# Altium schematic sheet 连接.SchDoc
size A4
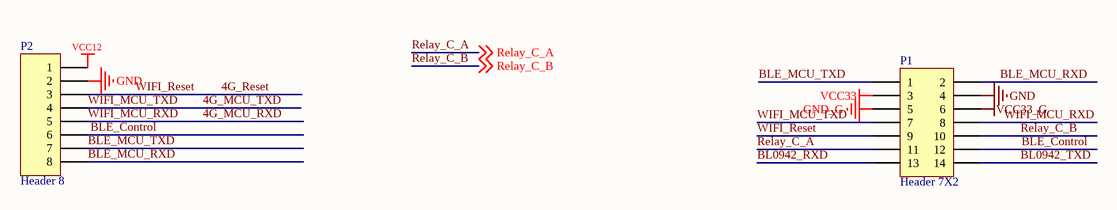
[diagram p0: 连接.SchDoc]

## Parts
P1  Header 7X2  [HDR2X7]
P2  Header 8  [HDR1X8]

## Nets
GND: P1.4 P2.2
GND_G: P1.5
VCC12: P2.1
VCC33: P1.3
VCC33_G: P1.6
4G_MCU_RXD: P1.8 P2.5  [also labelled WIFI_MCU_RXD]
4G_MCU_TXD: P1.7 P2.4  [also labelled WIFI_MCU_TXD]
4G_Reset: P1.9 P2.3  [also labelled WIFI_Reset]
BL0942_RXD: P1.13
BL0942_TXD: P1.14
BLE_Control: P1.12 P2.6
BLE_MCU_RXD: P1.2 P2.8
BLE_MCU_TXD: P1.1 P2.7
Relay_C_A: P1.11 ; off-sheet Relay_C_A
Relay_C_B: P1.10 ; off-sheet Relay_C_B

## Library data of the parts
P1 = Header 7X2: Header, 7-Pin, Dual row; LatestRevisionDate: 17-Jul-2002; LatestRevisionNote: Re-released for DXP Platform.; Publisher: Altium Limited
P2 = Header 8: Header, 8-Pin; LatestRevisionDate: 17-Jul-2002; LatestRevisionNote: Re-released for DXP Platform.; Publisher: Altium Limited